# Altium schematic sheet PWR_PROT_REV.SchDoc
size A4; SheetNumber: 5; SheetTotal: 15
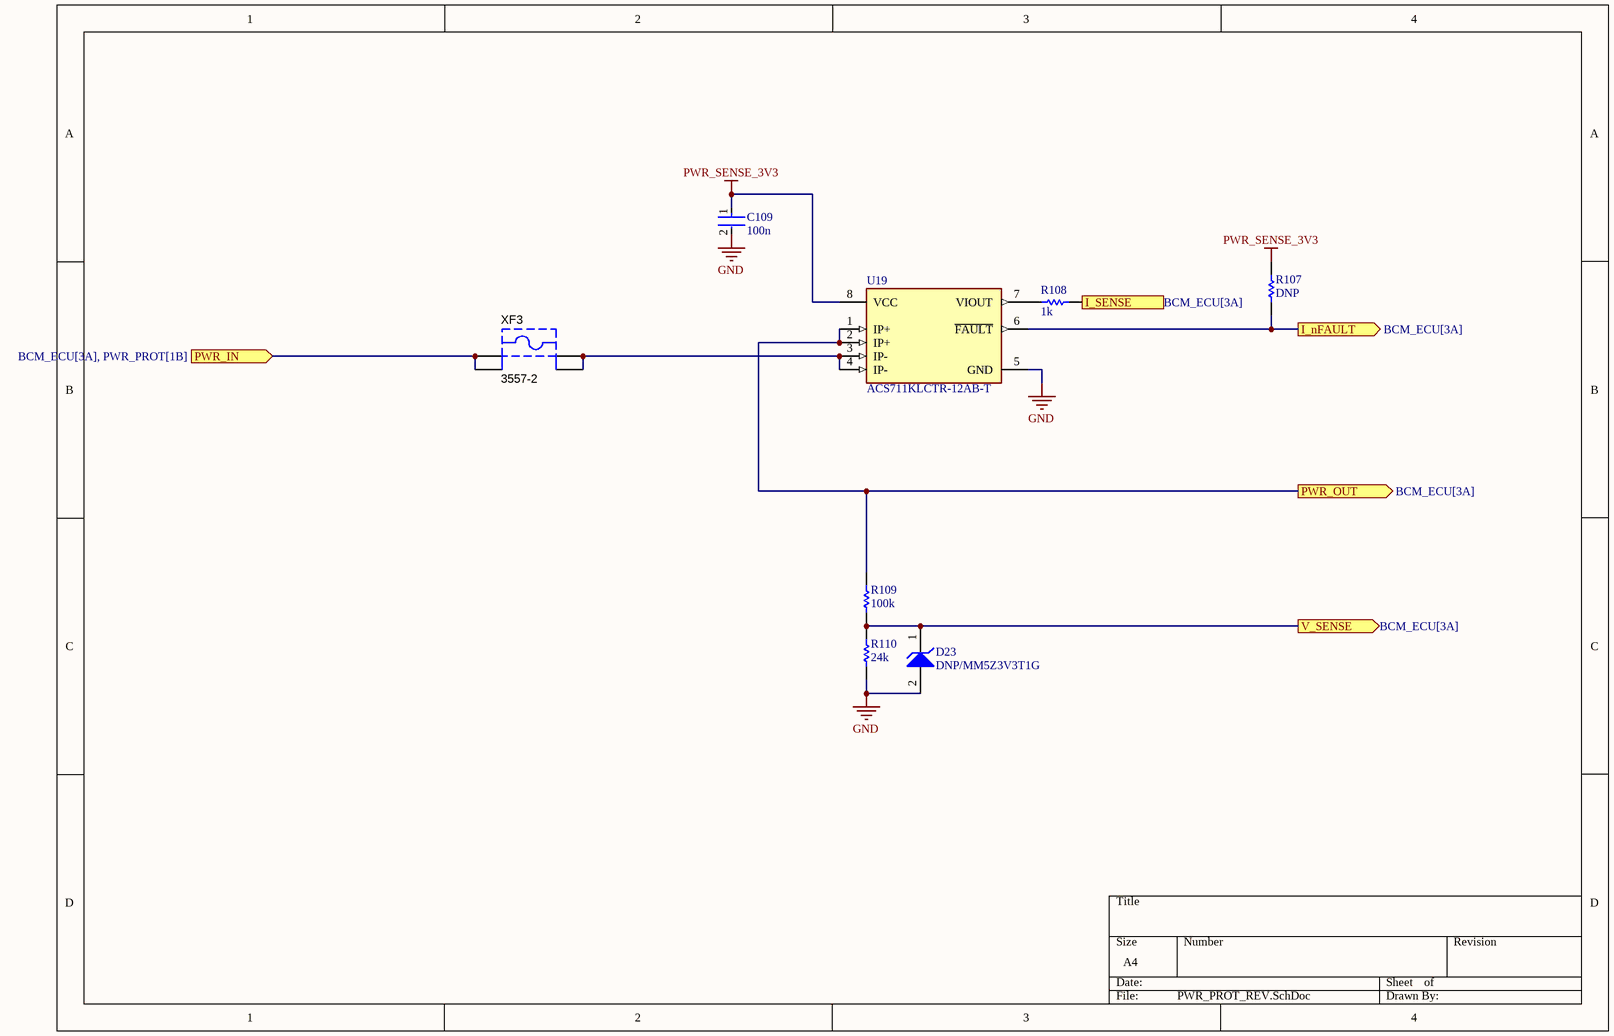
[diagram p0: PWR_PROT_REV.SchDoc]

## Parts
C109  100n  [FP-0402-L_1_0_0_05-W_0_5-IPC_A]
D23  DNP/MM5Z3V3T1G  [ONSC-SOD-523-2-502-01_V]
R107  DNP  [R0603B]
R108  1k  [R0603B]
R109  100k  [R0603B]
R110  24k  [R0603B]
U19  ACS711KLCTR-12AB-T  [FP-LC-8-IPC_C]
XF3  3557-2  [KSTN-3557-2]

## Ports
I_nFAULT (out, see BCM_ECU[3A]), I_SENSE (out, see BCM_ECU[3A]), PWR_IN (in, see BCM_ECU[3A], PWR_PROT[1B]), PWR_OUT (out, see BCM_ECU[3A]), V_SENSE (out, see BCM_ECU[3A])

## Nets
GND: C109.2 D23.2(A) R110.2 U19.5(GND)
PWR_SENSE_3V3: C109.1 R107.1 U19.8(VCC)
I_nFAULT: R107.2 U19.6(~{FAULT}) ; port I_nFAULT
I_SENSE: R108.1 ; port I_SENSE
PWR_IN: XF3.1 XF3.2 ; port PWR_IN
PWR_OUT: R109.1 U19.1(IP+) U19.2(IP+) ; port PWR_OUT
V_SENSE: D23.1(K) R109.2 R110.1 ; port V_SENSE
NetR108_2: R108.2 U19.7(VIOUT)
NetU19_3: U19.3(IP-) U19.4(IP-) XF3.3 XF3.4

## Library data of the parts
C109 = CMP-001-00058-1: LARGE PADS, 0402 CAP, CHANGE COMMENT TO MATCH REAL P/N; Capacitor Type: Ceramic; Min Operating Temperature: -55°C; Mounting Technology: Surface Mount; Pins: 2; Case/Package: 0402; RoHS Compliant: Yes; Max Operating Temperature: 85°C
D23 = CMP-1060-00750-1: Zener Voltage Regulator, 500 mW, 2-Pin SOD-523, Pb-Free, Tape and Reel; Manufacturer: On Semiconductor; P Max (W): 0.5; VZ Typ (V): 3.3; RoHS: Pb-Free; ComponentLink2Description: Datasheet; PackageReference: SOD-523-2-502-01; DatasheetVersion: Rev. 10; ComponentLink1Description: Manufacturer URL; PackageVersion: Rev. E, 09/2010; ComponentLink3URL: http://www.onsemi.com/pub_link/Collateral/502-01.PDF; ComponentLink2URL: http://www.onsemi.cn/pub_link/Collateral/MM5Z2V4T1-D.PDF; Mounting Technology: Surface Mount; PartNumber: MM5Z3V3T1G; Packing: Tape and Reel; PackageDescription: 2-Pin SOD, Body 1.2 x 0.8 mm; ComponentLink1URL: http://www.onsemi.com/; ComponentLink3Description: Package Specification
R107 R109 = CMP-009-00002-14: Resistor; Value: 10k
R108 = CMP-009-00002-14: Resistor; Value: 1k
R110 = CMP-009-00002-14: Resistor; Value: 2.7k
U19 = CMP-1557-00012-2: SENSOR CURRENT HALL 12.5A AC/DC; Number of Channels: 1; Min Supply Voltage: 3V; Sensitivity: 110mV/A; Response Time: 4.6us; Operating Supply Voltage: 3.3V; Max Supply Voltage: 5.5V; Max Supply Current: 5.5mA; Bandwidth: 100kHz; Linearity: 1%; Quiescent Current: 4mA; Accuracy: 5%; Polarity: Bidirectional; Case/Package: SOIC; Packaging: Tape and Reel; Number of Pins: 8; Width: 3.9mm; Frequency: 100kHz; -3db Bandwidth: 100kHz; REACH SVHC: No SVHC; Series: -; Height: 1.5mm; Package Quantity: 1; Min Operating Temperature: -40°C; Max Operating Temperature: 125°C; Current Sensing: 12.5A; RoHS Compliant: Yes; Length: 4.9mm
XF3 = CMP-2000-05461-1: FUSE HOLDER, PCB MOUNT, 500VAC, 20A, ROHS; Manufacturer: Keystone-Electronics; Number of Circuits: 1; Voltage: 500V; Fuseholder Type: Block; Fuse Type: Blade; Fuse Size: 0.43"Lx0.15"Wx0.64"H(10.92mmx3.81mmx16.25mm); For Use With/Related Products: ATC,ATO257,MINI897; Current Rating: 30A; Datasheet URL: http://datasheet.octopart.com/3557-2-Keystone-datasheet-15715937.pdf; Orientation: Vertical; Family: Fuseholders; Datasheet Version: Apr-13; Contact Finish: TinNickel; Mounting Type: PCB; Series: -; Category: CircuitProtection; Termination Style: PCPin; Contact Material: Brass; Manufacturer URL: http://www.keyelco.com/